# Altium schematic sheet atmega128rf.SchDoc: Microcontroller
size A3; CheckedBy: rrodrigu; Author: Satxo; CompanyName: Satxo; Revision: 0v1; SheetNumber: 3; SheetTotal: 8; ProjectName: Basesation
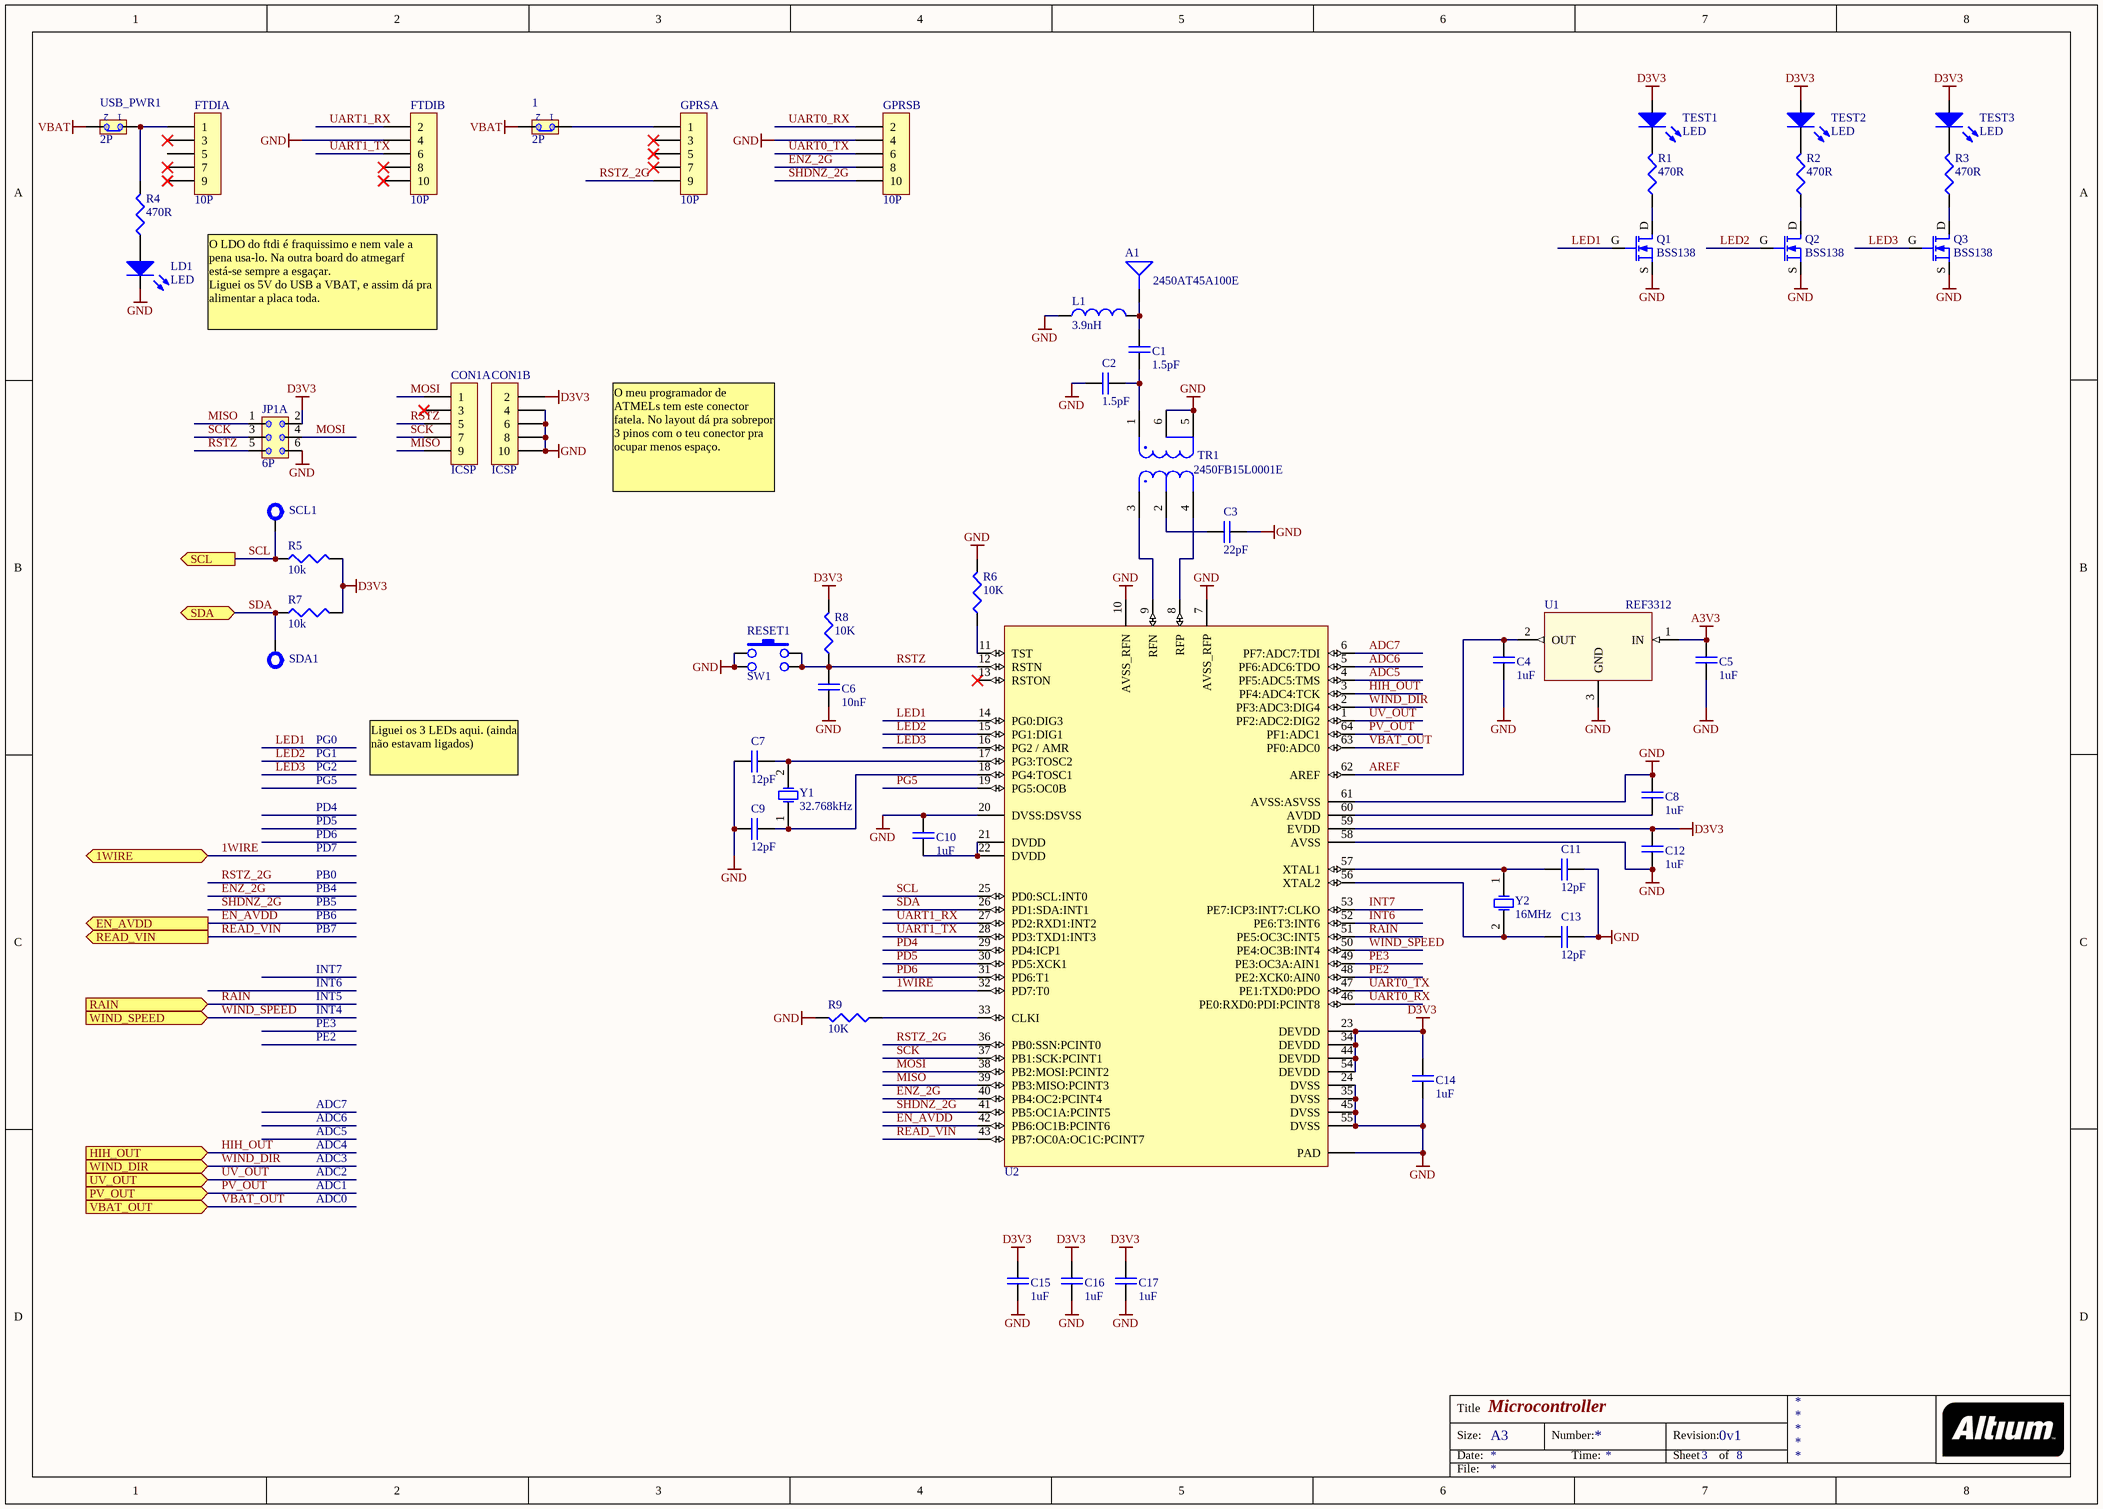
[diagram p0: atmega128rf.SchDoc]

## Parts
1  2P  [SIP-2]
A1  2450AT45A100E  [2450AT45A100E]
C1  1.5pF  [0402]
C2  1.5pF  [0402]
C3  22pF  [0402]
C4  1uF  [0603]
C5  1uF  [0603]
C6  10nF  [0603]
C7  12pF  [0603]
C8  1uF  [0603]
C9  12pF  [0603]
C10  1uF  [0603]
C11  12pF  [0603]
C12  1uF  [0603]
C13  12pF  [0603]
C14  1uF  [0603]
C15  1uF  [0603]
C16  1uF  [0603]
C17  1uF  [0603]
CON1  ICSP  [IDC-10-F]  (parts A,B of 2)
FTDI  10P  [IDC-10-90]  (parts A,B of 2)
GPRS  10P  [IDC-10-90]  (parts A,B of 2)
JP1  6P  [DIL-6]  (part A of 3)
L1  3.9nH  [0402]
LD1  LED  [0805@DIODE]
Q1  BSS138  [SOT-23@GSD]
Q2  BSS138  [SOT-23@GSD]
Q3  BSS138  [SOT-23@GSD]
R1  470R  [0603]
R2  470R  [0603]
R3  470R  [0603]
R4  470R  [0603]
R5  10k  [0603]
R6  10K  [0603]
R7  10k  [0603]
R8  10K  [0603]
R9  10K  [0603]
RESET1  SW1  [MICROSWITCH]
SCL1  Test Point  [TERMINAL]  (value not drawn)  (no BOM)
SDA1  Test Point  [TERMINAL]  (value not drawn)  (no BOM)
TEST1  LED  [0805@DIODE]
TEST2  LED  [0805@DIODE]
TEST3  LED  [0805@DIODE]
TR1  2450FB15L0001E  [0805@BALUN]
U1  REF3312  [SOT-23]
U2  ATmega128RFA1  [QFN-64@EP]  (value not drawn)
USB_PWR1  2P  [SIP-2]
Y1  32.768kHz  [HC-49U]
Y2  16MHz  [HC-49U]

## Ports
1WIRE (bidir), EN_AVDD (out), HIH_OUT (in), PV_OUT (in), RAIN (in), READ_VIN (out), SCL (out), SDA (bidir), UV_OUT (in), VBAT_OUT (in), WIND_DIR (in), WIND_SPEED (in)

## Nets
A3V3: C5.1 U1.1(IN)
D3V3: C12.2 C14.2 C15.2 C16.2 C17.2 CON1.2 JP1.2 R5.2 R7.2 R8.2 TEST1.A TEST2.A TEST3.A U2.23(DEVDD) U2.34(DEVDD) U2.44(DEVDD) U2.54(DEVDD) U2.59(EVDD)
GND: C2.1 C3.2 C4.2 C5.2 C6.2 C7.1 C8.2 C9.1 C10.2 C11.2 C12.1 C13.2 C14.1 C15.1 C16.1 C17.1 CON1.4 CON1.6 CON1.8 CON1.10 FTDI.4 GPRS.4 JP1.6 L1.1 LD1.K Q1.S Q2.S Q3.S R6.2 R9.2 RESET1.1 RESET1.3 TR1.5(Ground) TR1.6(Ground) U1.3(GND) U2.7(AVSS_RFP) U2.10(AVSS_RFN) U2.20(DVSS:DSVSS) U2.24(DVSS) U2.35(DVSS) U2.45(DVSS) U2.55(DVSS) U2.58(AVSS) U2.61(AVSS:ASVSS) U2.PAD
VBAT: 1.2 USB_PWR1.2
1WIRE: U2.32(PD7:T0) ; port 1WIRE
ADC5: U2.4(PF5:ADC5:TMS)
ADC6: U2.5(PF6:ADC6:TDO)
ADC7: U2.6(PF7:ADC7:TDI)
AREF: C4.1 U1.2(OUT) U2.62(AREF)
EN_AVDD: U2.42(PB6:OC1B:PCINT6) ; port EN_AVDD
ENZ_2G: GPRS.8 U2.40(PB4:OC2:PCINT4)
HIH_OUT: U2.3(PF4:ADC4:TCK) ; port HIH_OUT
INT6: U2.52(PE6:T3:INT6)
INT7: U2.53(PE7:ICP3:INT7:CLKO)
LED1: Q1.G U2.14(PG0:DIG3)
LED2: Q2.G U2.15(PG1:DIG1)
LED3: Q3.G U2.16(PG2_/_AMR)
MISO: CON1.9 JP1.1 U2.39(PB3:MISO:PCINT3)
MOSI: CON1.1 JP1.4 U2.38(PB2:MOSI:PCINT2)
PD4: U2.29(PD4:ICP1)
PD5: U2.30(PD5:XCK1)
PD6: U2.31(PD6:T1)
PE2: U2.48(PE2:XCK0:AIN0)
PE3: U2.49(PE3:OC3A:AIN1)
PG5: U2.19(PG5:OC0B)
PV_OUT: U2.64(PF1:ADC1) ; port PV_OUT
RAIN: U2.51(PE5:OC3C:INT5) ; port RAIN
READ_VIN: U2.43(PB7:OC0A:OC1C:PCINT7) ; port READ_VIN
RSTZ: C6.1 CON1.5 JP1.5 R8.1 RESET1.2 RESET1.4 U2.12(RSTN)
RSTZ_2G: GPRS.9 U2.36(PB0:SSN:PCINT0)
SCK: CON1.7 JP1.3 U2.37(PB1:SCK:PCINT1)
SCL: R5.1 SCL1.1(TP) U2.25(PD0:SCL:INT0) ; port SCL
SDA: R7.1 SDA1.1(TP) U2.26(PD1:SDA:INT1) ; port SDA
SHDNZ_2G: GPRS.10 U2.41(PB5:OC1A:PCINT5)
UART0_RX: GPRS.2 U2.46(PE0:RXD0:PDI:PCINT8)
UART0_TX: GPRS.6 U2.47(PE1:TXD0:PDO)
UART1_RX: FTDI.2 U2.27(PD2:RXD1:INT2)
UART1_TX: FTDI.6 U2.28(PD3:TXD1:INT3)
UV_OUT: U2.1(PF2:ADC2:DIG2) ; port UV_OUT
VBAT_OUT: U2.63(PF0:ADC0) ; port VBAT_OUT
WIND_DIR: U2.2(PF3:ADC3:DIG4) ; port WIND_DIR
WIND_SPEED: U2.50(PE4:OC3B:INT4) ; port WIND_SPEED
Net1_1: 1.1 GPRS.1
NetA1_1: A1.1 C1.2 L1.2
NetC1_1: C1.1 C2.2 TR1.1(Unbalanced_Port)
NetC3_1: C3.1 TR1.2(DC_Feed_+_RF_GND)
NetC7_2: C7.2 U2.17(PG3:TOSC2) Y1.2(OSC2)
NetC8_1: C8.1 U2.60(AVDD)
NetC9_2: C9.2 U2.18(PG4:TOSC1) Y1.1(OSC1)
NetC10_1: C10.1 U2.21(DVDD) U2.22(DVDD)
NetC11_1: C11.1 U2.57(XTAL1) Y2.1(OSC1)
NetC13_1: C13.1 U2.56(XTAL2) Y2.2(OSC2)
NetFTDI_1: FTDI.1 R4.2 USB_PWR1.1
NetLD1_A: LD1.A R4.1
NetQ1_D: Q1.D R1.1
NetQ2_D: Q2.D R2.1
NetQ3_D: Q3.D R3.1
NetR1_2: R1.2 TEST1.K
NetR2_2: R2.2 TEST2.K
NetR3_2: R3.2 TEST3.K
NetR6_1: R6.1 U2.11(TST)
NetR9_1: R9.1 U2.33(CLKI)
NetTR1_3: TR1.3(Balanced_Port) U2.9(RFN)
NetTR1_4: TR1.4(Balanced_Port) U2.8(RFP)

Not connected (* = marked no-connect by the designer): CON1 3*; FTDI 3* 5 7* 8* 9* 10*; GPRS 3* 5* 7*; U2 13(RSTON)*

## Notes on the sheet
- O LDO do ftdi é fraquissimo e nem vale a pena usa-lo. Na outra board do atmegarf está-se sempre a esgaçar.
  Liguei os 5V do USB a VBAT, e assim dá pra alimentar a placa toda.
- O meu programador de ATMELs tem este conector fatela. No layout dá pra sobrepor 3 pinos com o teu conector pra ocupar menos espaço.
- PG0
- PG1
- PG2
- PG5
- Liguei os 3 LEDs aqui. (ainda não estavam ligados)
- PD4
- PD5
- PD6
- PD7
- PB0
- PB4
- PB5
- PB6
- INT6
- INT7
- PB7
- PE2
- PE3
- INT4
- INT5
- ADC6
- ADC7
- ADC1
- ADC2
- ADC3
- ADC4
- ADC5
- ADC0
- Title
- Size:
- Date:
- A3
- Number:
- Time:
- Revision:
- Sheet
- of
- File:

## Library data of the parts
1 USB_PWR1 = JMP2: 2-pin Jumper; Owner: Nuno Brum; Sub-Type: Connector; STATE1: 1; Assembly: INS; Validation Date: 2006-05-15; Creation Date: 2002-07-17; Status: Valid; Type: Electrical & Mechanical
A1 = Antenna SE: ANTENNA
C1-C17 = CAP: Capacitor; Owner: Nuno Brum; Sub-Type: Ceramic; Assembly: INS; Maximum Voltage: *; Creation Date: 2005-04-28; Status: Valid; Validation date: 2006-05-15; Type: Capacitor
CON1 FTDI GPRS = CON10: Connector 10 Pins; Owner: António Silva; Assembly: INS; Sub-Type: Connector; Creation Date: 2005-11-21; Status: Valid; Validation Date: 2006-05-15; Type: Electrical & Mechanical
JP1 = JMP6: 6-Pin Jumper; Sub-Type: Connector; Owner: Rui Rebelo; Assembly: INS; Creation Date: 2005-07-17; Status: Valid; Validation Date: 2006-05-15; Type: Electrical & Mechanical
L1 = IND: Inductor; Owner: Nuno Brum; Sub-Type: Generic; Assembly: INS; Validation date: 2006-05-15; Creation Date: 2002-07-17; Status: Valid; Type: Inductor
LD1 TEST1-TEST3 = LED: Light emitting diode; Owner: Nuno Brum; Assembly: INS; Creation Date: 2001-06-05; Sub-Type: LED; Status: Valid; Validation date: 2006-05-15; Model: LED; Type: Diode
Q1-Q3 = MOSFET-N: N-Channel Logic Level Enhancement Mode Field Effect Transistor; pin to pad: 2>3 3>2; Owner: Nuno Brum; Sub-Type: MOSFET; Assembly: INS; Creation Date: 2001-06-05; Status: Valid; Model: BSS138; Type: Transistor
R1-R9 = RES: Resistor; Owner: Nuno Brum; Sub-Type: Generic; Assembly: INS; Validation date: 2006-05-15; Creation Date: 2002-07-17; Status: Valid; Power: *; Type: Resistor
RESET1 = SW1: Switch Push Button; Owner: Nuno Brum; Assembly: INS; Validation Date: 2006-05-15; Sub-Type: Switch; Creation Date: 2002-07-17; Status: Valid; Type: Electrical & Mechanical
SCL1 SDA1 = TEST-PROBE: Test/Probe Point; Owner: Nuno Brum; Sub-Type: Mechanical; Assembly: PCB; Validation Date: 2006-05-15; Type: PCB; Creation Date: 2005-06-01; Status: Valid
TR1 = 2450FB15L0001E: FILTER BALUN ATMEL 2.45GHZ; Owner: Rui Rebelo; Sub-Type: Transformer; Type: Electrical & Mechanical; Assembly: INS; Creation Date: 2002-07-25; Status: New
U1 = REF3312: Voltage Reference 1.25V, 30ppm/degC, 5mA; Type: IC; Creation Date: 2012-12-09
U2 = ATmega128RFA1: 802.15.4 compliant AVR transceiver; verified by: vlarsen; verified date: 2010-12-05; Status: Verified
Y1 Y2 = Crystal Oscillator: Published: 17-Jul-2002; DatasheetDocument: 18-Apr-2000; PackageReference: CSM-7; Publisher: Altium Limited; ComponentLink1Description: Manufacturer Link; ComponentLink1URL: http://www.ecsxtal.com/; ComponentLink2Description: Datasheet; ComponentLink2URL: http://www.ecsxtal.com/pdf3/CSM_7.pdf